# EAGLE design PCU (EAGLE 9.5.1)
ESKD_DESCRIPTION1: 207|235|224|242|224|32|192|208|202; ESKD_DESCRIPTION2: 241|245|229|236|224|32|253|235|229|234|242|240|232|247|229|241|234|224|255; ESKD_DESCRIPTION3: 239|240|232|237|246|232|239|232|224|235|252|237|224|255; ESKD_NUMBER: 67|67|83|49|46|51|49|48|48|45|48|221|51; ESKD_NUMBER_SHEET: 49; ESKD_SHEETS: 49
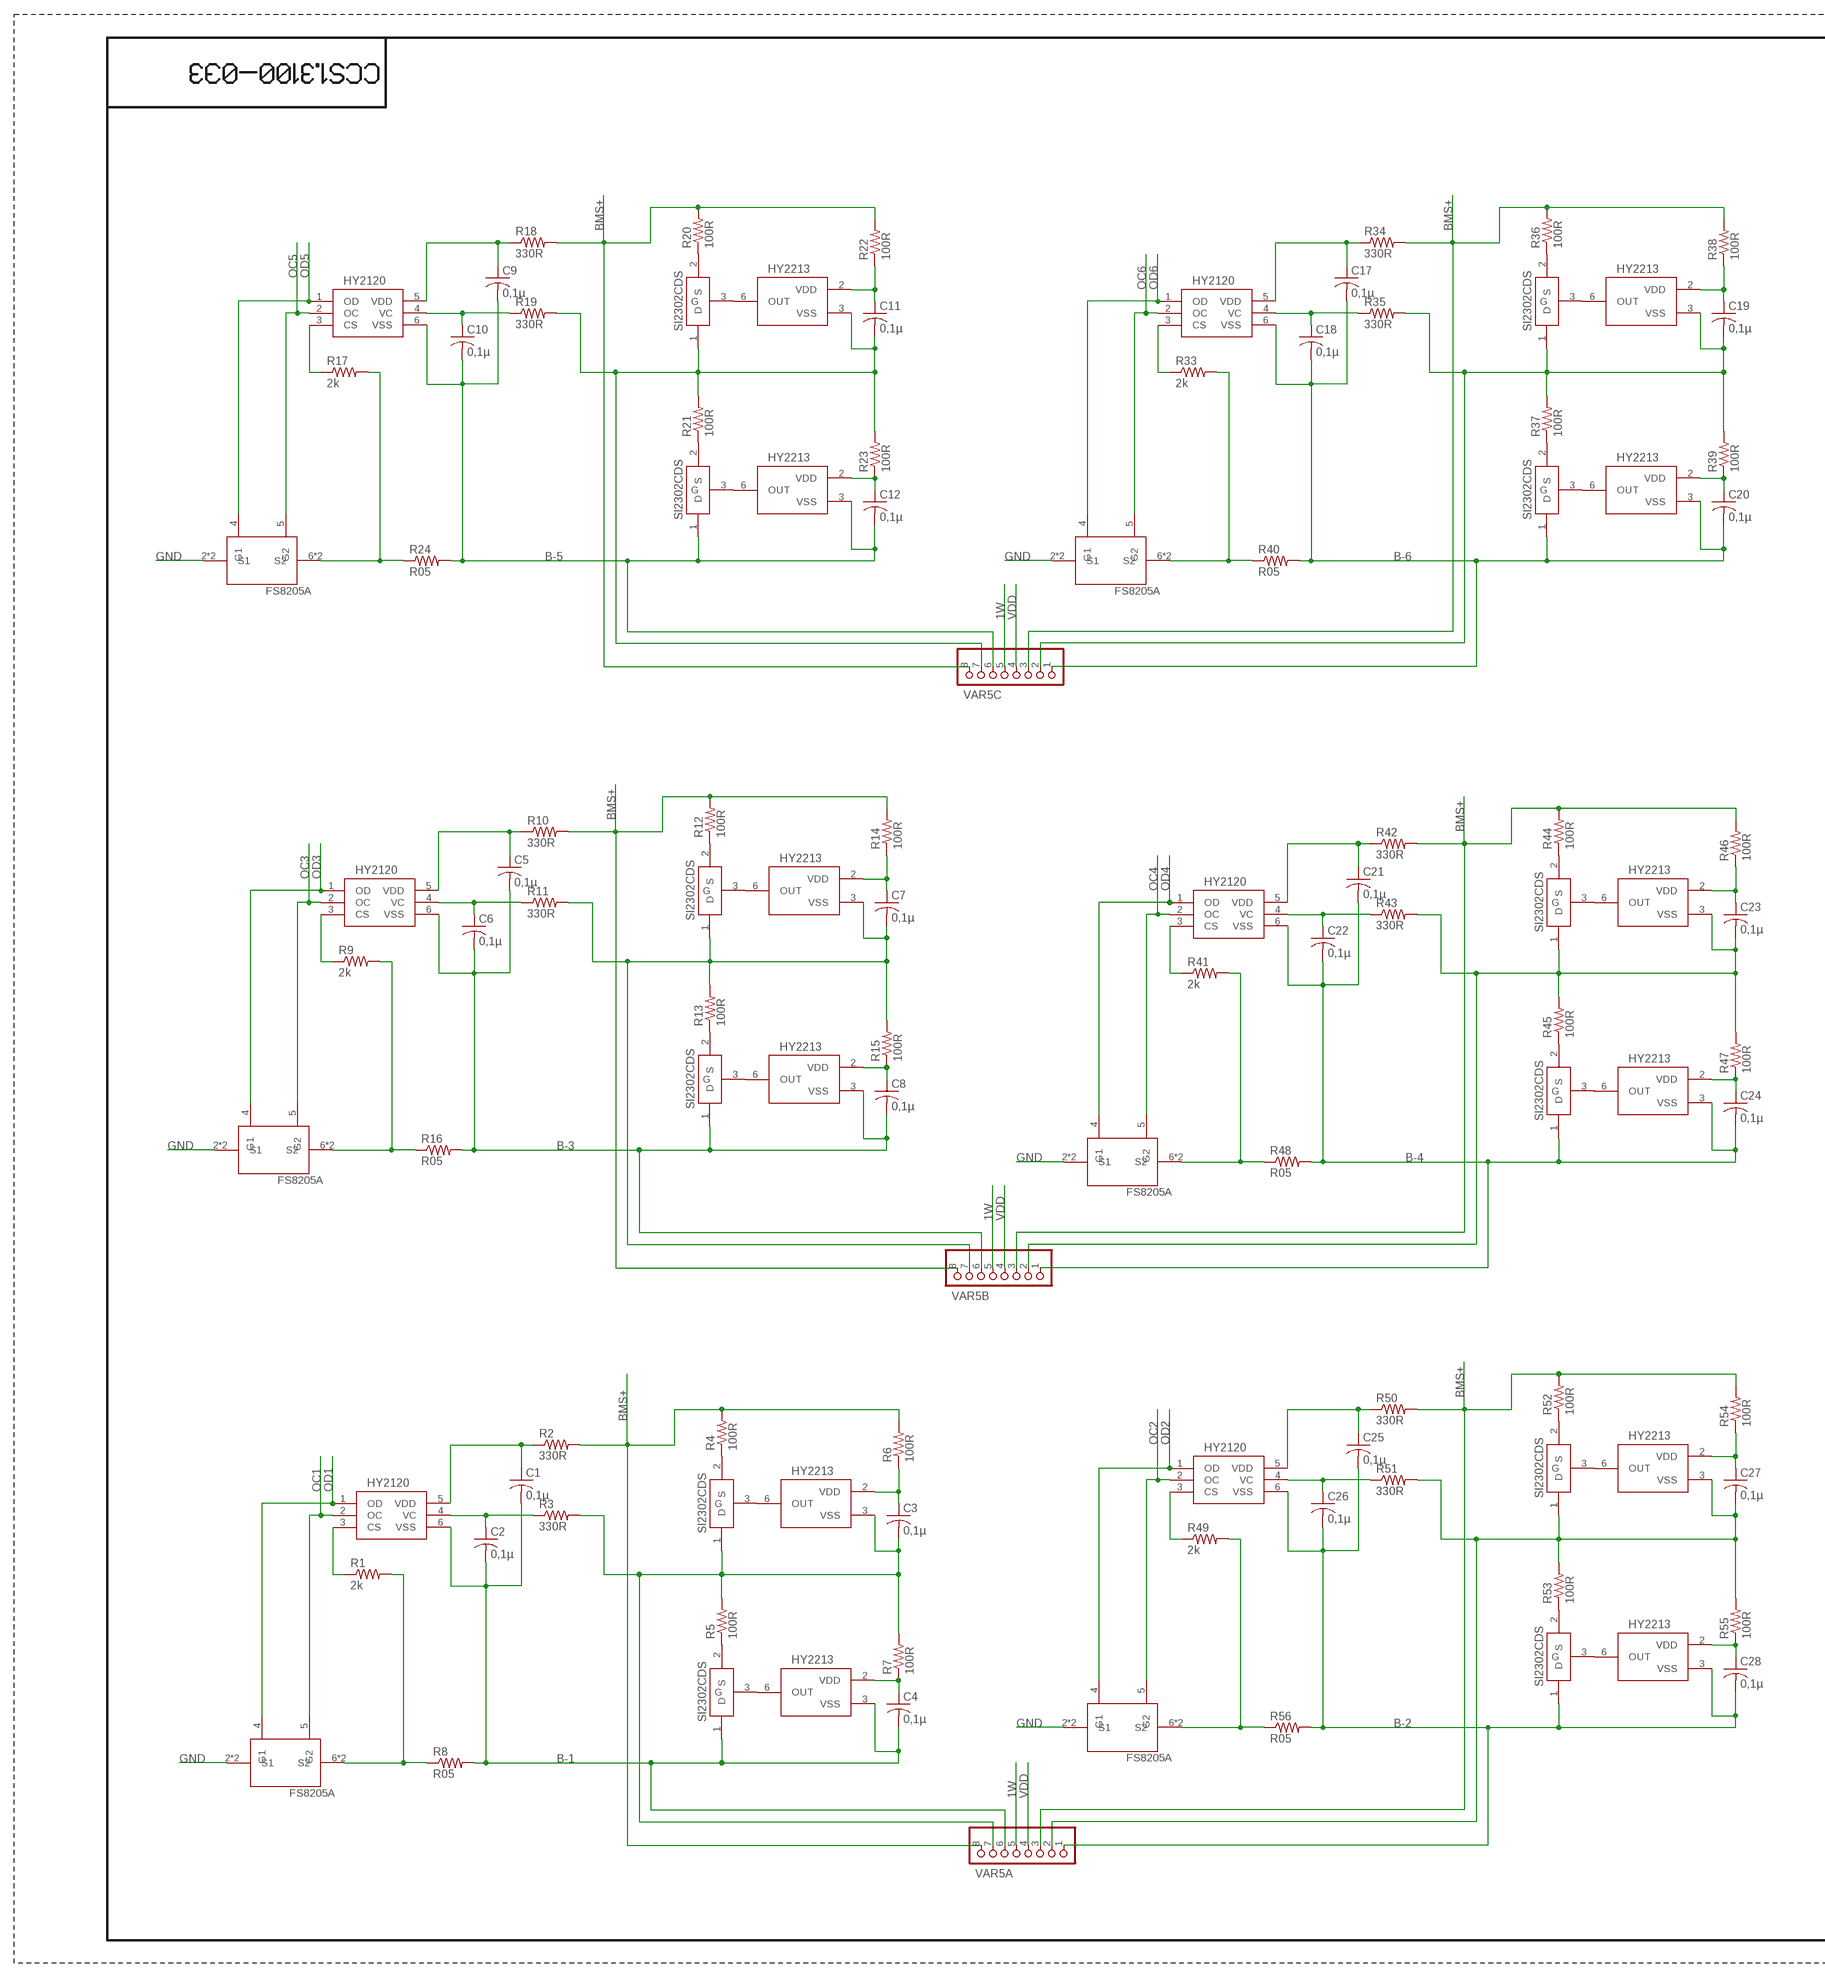
[diagram p0: schematic, sheet 1, part 1 of 2]
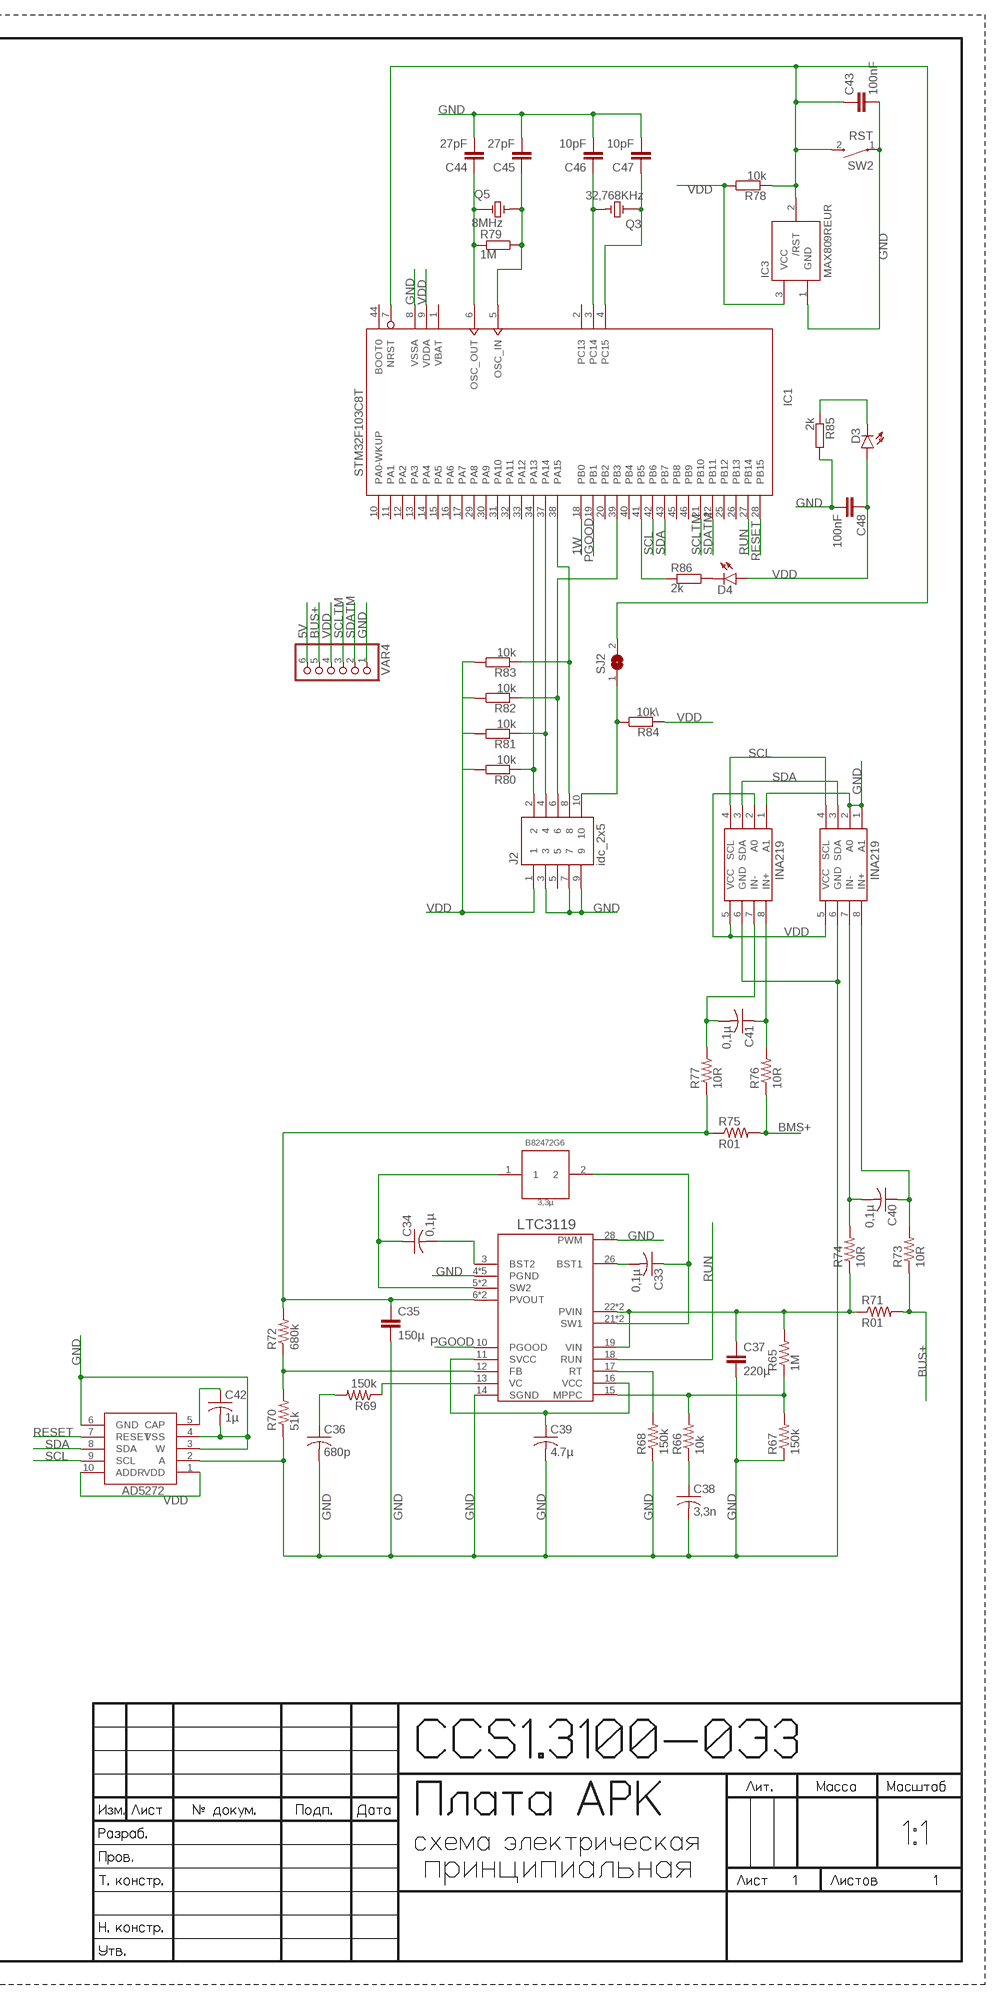
[diagram p1: schematic, sheet 1, part 2 of 2]

## Parts
3,3µH  3,3µ  B82472G6  [B82472G6]
C1  0,1µ  C-USC0603  [C0603]
C2  0,1µ  C-USC0603  [C0603]
C3  0,1µ  C-USC0603  [C0603]
C4  0,1µ  C-USC0603  [C0603]
C5  0,1µ  C-USC0603  [C0603]
C6  0,1µ  C-USC0603  [C0603]
C7  0,1µ  C-USC0603  [C0603]
C8  0,1µ  C-USC0603  [C0603]
C9  0,1µ  C-USC0603  [C0603]
C10  0,1µ  C-USC0603  [C0603]
C11  0,1µ  C-USC0603  [C0603]
C12  0,1µ  C-USC0603  [C0603]
C17  0,1µ  C-USC0603  [C0603]
C18  0,1µ  C-USC0603  [C0603]
C19  0,1µ  C-USC0603  [C0603]
C20  0,1µ  C-USC0603  [C0603]
C21  0,1µ  C-USC0603  [C0603]
C22  0,1µ  C-USC0603  [C0603]
C23  0,1µ  C-USC0603  [C0603]
C24  0,1µ  C-USC0603  [C0603]
C25  0,1µ  C-USC0603  [C0603]
C26  0,1µ  C-USC0603  [C0603]
C27  0,1µ  C-USC0603  [C0603]
C28  0,1µ  C-USC0603  [C0603]
C33  0,1µ  C-USC0603  [C0603]
C34  0,1µ  C-USC0603  [C0603]
C35  150µ  ECAPECAP150  [ECAP150]
C36  680p  C-USC1206  [C1206]
C37  220µ  ECAPECAP220  [ECAP220]
C38  3,3n  C-USC1206  [C1206]
C39  4.7µ  C-USC1206  [C1206]
C40  0,1µ  C-USC0603  [C0603]
C41  0,1µ  C-USC0603  [C0603]
C42  1µ  C-USC0603  [C0603]
C43  100nF  C-EUC0603  [C0603]
C44  27pF  C-EUC0603  [C0603]
C45  27pF  C-EUC0603  [C0603]
C46  10pF  C-EUC0603  [C0603]
C47  10pF  C-EUC0603  [C0603]
C48  100nF  C-EUC0603  [C0603]
D3  HLMP6  [HLMP6]
D4  HLMP6  [HLMP6]
IC1  STM32F103C8T  [LQFP48]
IC3  MAX809REUR  MAX809EUR  [SOT23]
J2  idc_2x5  3221-10-0100-00  [CNC_3221-10-0100-00]
Q3  32,768KHz  9C-8.000MEEJ-T  [XTAL_9C-8.000MEEJ-T]
Q5  8MHz  9C-8.000MEEJ-T  [XTAL_9C-8.000MEEJ-T]
R1  2k  R-US_R0603  [R0603]
R2  330R  R-US_R0603  [R0603]
R3  330R  R-US_R0603  [R0603]
R4  100R  R-US_R0603  [R0603]
R5  100R  R-US_R0603  [R0603]
R6  100R  R-US_R0603  [R0603]
R7  100R  R-US_R0603  [R0603]
R8  R05  R-US_R2512  [R2512]
R9  2k  R-US_R0603  [R0603]
R10  330R  R-US_R0603  [R0603]
R11  330R  R-US_R0603  [R0603]
R12  100R  R-US_R0603  [R0603]
R13  100R  R-US_R0603  [R0603]
R14  100R  R-US_R0603  [R0603]
R15  100R  R-US_R0603  [R0603]
R16  R05  R-US_R2512  [R2512]
R17  2k  R-US_R0603  [R0603]
R18  330R  R-US_R0603  [R0603]
R19  330R  R-US_R0603  [R0603]
R20  100R  R-US_R0603  [R0603]
R21  100R  R-US_R0603  [R0603]
R22  100R  R-US_R0603  [R0603]
R23  100R  R-US_R0603  [R0603]
R24  R05  R-US_R2512  [R2512]
R33  2k  R-US_R0603  [R0603]
R34  330R  R-US_R0603  [R0603]
R35  330R  R-US_R0603  [R0603]
R36  100R  R-US_R0603  [R0603]
R37  100R  R-US_R0603  [R0603]
R38  100R  R-US_R0603  [R0603]
R39  100R  R-US_R0603  [R0603]
R40  R05  R-US_R2512  [R2512]
R41  2k  R-US_R0603  [R0603]
R42  330R  R-US_R0603  [R0603]
R43  330R  R-US_R0603  [R0603]
R44  100R  R-US_R0603  [R0603]
R45  100R  R-US_R0603  [R0603]
R46  100R  R-US_R0603  [R0603]
R47  100R  R-US_R0603  [R0603]
R48  R05  R-US_R2512  [R2512]
R49  2k  R-US_R0603  [R0603]
R50  330R  R-US_R0603  [R0603]
R51  330R  R-US_R0603  [R0603]
R52  100R  R-US_R0603  [R0603]
R53  100R  R-US_R0603  [R0603]
R54  100R  R-US_R0603  [R0603]
R55  100R  R-US_R0603  [R0603]
R56  R05  R-US_R2512  [R2512]
R65  1M  R-US_R0603  [R0603]
R66  10k  R-US_R0603  [R0603]
R67  150k  R-US_R0603  [R0603]
R68  150k  R-US_R0603  [R0603]
R69  150k  R-US_R0603  [R0603]
R70  51k  R-US_R0603  [R0603]
R71  R01  R-US_R2512  [R2512]
R72  680k  R-US_R0603  [R0603]
R73  10R  R-US_R0603  [R0603]
R74  10R  R-US_R0603  [R0603]
R75  R01  R-US_R2512  [R2512]
R76  10R  R-US_R0603  [R0603]
R77  10R  R-US_R0603  [R0603]
R78  10k  BVS  [BVS]
R79  1M  BVS  [BVS]
R80  10k  BVS  [BVS]
R81  10k  BVS  [BVS]
R82  10k  BVS  [BVS]
R83  10k  BVS  [BVS]
R84  10k\  BVS  [BVS]
R85  2k  BVS  [BVS]
R86  2k  BVS  [BVS]
SJ2  SJW  [SJW]
SW2  RST  1437566-3  [SW_1437566-3]
U$1  FS8205A  [FS8205A]
U$3  HY2120  [HY2120]
U$4  HY2213  [HY2213]
U$5  HY2213  [HY2213]
U$6  SI2302CDS  [SI2302CDS]
U$7  SI2302CDS  [SI2302CDS]
U$8  FS8205A  [FS8205A]
U$10  HY2120  [HY2120]
U$11  HY2213  [HY2213]
U$12  HY2213  [HY2213]
U$13  SI2302CDS  [SI2302CDS]
U$14  SI2302CDS  [SI2302CDS]
U$15  FS8205A  [FS8205A]
U$17  HY2120  [HY2120]
U$18  HY2213  [HY2213]
U$19  HY2213  [HY2213]
U$20  SI2302CDS  [SI2302CDS]
U$21  SI2302CDS  [SI2302CDS]
U$29  FS8205A  [FS8205A]
U$31  HY2120  [HY2120]
U$32  HY2213  [HY2213]
U$33  HY2213  [HY2213]
U$34  SI2302CDS  [SI2302CDS]
U$35  SI2302CDS  [SI2302CDS]
U$36  FS8205A  [FS8205A]
U$38  HY2120  [HY2120]
U$39  HY2213  [HY2213]
U$40  HY2213  [HY2213]
U$41  SI2302CDS  [SI2302CDS]
U$42  SI2302CDS  [SI2302CDS]
U$43  FS8205A  [FS8205A]
U$45  HY2120  [HY2120]
U$46  HY2213  [HY2213]
U$47  HY2213  [HY2213]
U$48  SI2302CDS  [SI2302CDS]
U$49  SI2302CDS  [SI2302CDS]
U$57  INA219AID  [INA219AID]
U$58  INA219AID  [INA219AID]
U$59  LTC3119  [LTC3119]
U$60  AD5272  [AD5272]
VAR4  PINHD-1X6  [1X06]
VAR5A  PINHD-1X8  [1X08]
VAR5B  PINHD-1X8  [1X08]
VAR5C  PINHD-1X8  [1X08]

## Nets
1W: IC1.18(PB0) VAR5A.5 VAR5B.5 VAR5C.5
5V: VAR4.6
B-1: C1.2 C2.2 C4.2 R8.2 U$3.6(VSS) U$5.3(VSS) U$7.1(D) VAR5A.6
B-2: C25.2 C26.2 C28.2 R56.2 U$45.6(VSS) U$47.3(VSS) U$49.1(D) VAR5A.1
B-3: C5.2 C6.2 C8.2 R16.2 U$10.6(VSS) U$12.3(VSS) U$14.1(D) VAR5B.6
B-4: C21.2 C22.2 C24.2 R48.2 U$38.6(VSS) U$40.3(VSS) U$42.1(D) VAR5B.1
B-5: C9.2 C10.2 C12.2 R24.2 U$17.6(VSS) U$19.3(VSS) U$21.1(D) VAR5C.6
B-6: C17.2 C18.2 C20.2 R40.2 U$31.6(VSS) U$33.3(VSS) U$35.1(D) VAR5C.1
BMS+: R2.2 R4.2 R6.2 R10.2 R12.2 R14.2 R18.2 R20.2 R22.2 R34.2 R36.2 R38.2 R42.2 R44.2 R46.2 R50.2 R52.2 R54.2 R75.2 R76.1 VAR5A.3 VAR5A.8 VAR5B.3 VAR5B.8 VAR5C.3 VAR5C.8
BUS+: R71.2 R73.1 VAR4.5
GND: C35.P$2 C36.2 C37.P$2 C38.2 C39.2 C42.2 C43.2 C44.2 C45.2 C46.2 C47.2 C48.2 IC1.8(VSSA) IC3.1(GND) J2.3 J2.7 J2.9 R67.1 R68.1 R70.1 R85.1 SW2.1 U$1.2(S1) U$1.3(S1) U$8.2(S1) U$8.3(S1) U$15.2(S1) U$15.3(S1) U$29.2(S1) U$29.3(S1) U$36.2(S1) U$36.3(S1) U$43.2(S1) U$43.3(S1) U$57.1(A1) U$57.6(GND) U$58.1(A1) U$58.2(A0) U$58.6(GND) U$59.4(PGND) U$59.9(PGND) U$59.14(SGND) U$59.20(PGND) U$59.25(PGND) U$59.28(PWM) U$59.29(PGND) U$60.2(A) U$60.3(W) U$60.4(VSS) U$60.6(GND) VAR4.1
N$1: C1.1 R2.1 U$3.5(VDD)
N$2: C4.1 R7.1 U$5.2(VDD)
N$3: R1.1 U$3.3(CS)
N$4: C3.1 R6.1 U$4.2(VDD)
N$5: C43.1 IC1.7(NRST) IC3.2(/RST) R78.2 SJ2.2 SW2.2
N$6: U$4.6(OUT) U$6.3(G)
N$7: R4.1 U$6.2(S)
N$8: C3.2 R3.2 R5.2 R7.2 U$4.3(VSS) U$6.1(D) VAR5A.7
N$9: U$5.6(OUT) U$7.3(G)
N$10: R5.1 U$7.2(S)
N$13: R1.2 R8.1 U$1.6(S2) U$1.7(S2)
N$15: C2.1 R3.1 U$3.4(VC)
N$16: C5.1 R10.1 U$10.5(VDD)
N$18: R9.1 U$10.3(CS)
N$19: C7.1 R14.1 U$11.2(VDD)
N$20: U$11.6(OUT) U$13.3(G)
N$21: R12.1 U$13.2(S)
N$22: U$12.6(OUT) U$14.3(G)
N$23: R13.1 U$14.2(S)
N$24: R9.2 R16.1 U$8.6(S2) U$8.7(S2)
N$27: C6.1 R11.1 U$10.4(VC)
N$28: C8.1 R15.1 U$12.2(VDD)
N$30: C7.2 R11.2 R13.2 R15.2 U$11.3(VSS) U$13.1(D) VAR5B.7
N$33: C9.1 R18.1 U$17.5(VDD)
N$34: R17.1 U$17.3(CS)
N$35: C11.1 R22.1 U$18.2(VDD)
N$36: U$18.6(OUT) U$20.3(G)
N$37: R20.1 U$20.2(S)
N$38: U$19.6(OUT) U$21.3(G)
N$39: R21.1 U$21.2(S)
N$40: R17.2 R24.1 U$15.6(S2) U$15.7(S2)
N$43: C10.1 R19.1 U$17.4(VC)
N$44: C12.1 R23.1 U$19.2(VDD)
N$46: C11.2 R19.2 R21.2 R23.2 U$18.3(VSS) U$20.1(D) VAR5C.7
N$65: C17.1 R34.1 U$31.5(VDD)
N$66: R33.1 U$31.3(CS)
N$67: C19.1 R38.1 U$32.2(VDD)
N$68: U$32.6(OUT) U$34.3(G)
N$69: R36.1 U$34.2(S)
N$70: U$33.6(OUT) U$35.3(G)
N$71: R37.1 U$35.2(S)
N$72: R33.2 R40.1 U$29.6(S2) U$29.7(S2)
N$75: C18.1 R35.1 U$31.4(VC)
N$76: C20.1 R39.1 U$33.2(VDD)
N$78: C19.2 R35.2 R37.2 R39.2 U$32.3(VSS) U$34.1(D) VAR5C.2
N$81: C21.1 R42.1 U$38.5(VDD)
N$82: R41.1 U$38.3(CS)
N$83: C23.1 R46.1 U$39.2(VDD)
N$84: U$39.6(OUT) U$41.3(G)
N$85: R44.1 U$41.2(S)
N$86: U$40.6(OUT) U$42.3(G)
N$87: R45.1 U$42.2(S)
N$88: R41.2 R48.1 U$36.6(S2) U$36.7(S2)
N$91: C22.1 R43.1 U$38.4(VC)
N$92: C24.1 R47.1 U$40.2(VDD)
N$94: C23.2 R43.2 R45.2 R47.2 U$39.3(VSS) U$41.1(D) VAR5B.2
N$97: C25.1 R50.1 U$45.5(VDD)
N$98: R49.1 U$45.3(CS)
N$99: C27.1 R54.1 U$46.2(VDD)
N$100: U$46.6(OUT) U$48.3(G)
N$101: R52.1 U$48.2(S)
N$102: U$47.6(OUT) U$49.3(G)
N$103: R53.1 U$49.2(S)
N$104: R49.2 R56.1 U$43.6(S2) U$43.7(S2)
N$107: C26.1 R51.1 U$45.4(VC)
N$108: C28.1 R55.1 U$47.2(VDD)
N$110: C27.2 R51.2 R53.2 R55.2 U$46.3(VSS) U$48.1(D) VAR5A.2
N$129: C34.2 U$59.3(BST2)
N$131: 3,3µH.2 C33.1 U$59.21(SW1) U$59.24(SW1)
N$132: 3,3µH.1 C34.1 U$59.5(SW2) U$59.8(SW2)
N$133: C44.1 IC1.6(OSC_OUT) Q5.1 R79.2
N$134: C35.P$1 R72.2 R75.1 R77.1 U$59.6(PVOUT) U$59.7(PVOUT)
N$135: R69.1 U$59.13(VC)
N$136: C36.1 R69.2
N$137: C37.P$1 R65.2 R71.1 R74.1 U$59.19(VIN) U$59.22(PVIN) U$59.23(PVIN)
N$138: R65.1 R66.2 R67.2 U$59.15(MPPC)
N$139: C38.1 R66.1
N$140: C39.1 U$59.11(SVCC) U$59.16(VCC)
N$141: C40.2 R74.2 U$58.7(IN-)
N$142: R68.2 U$59.17(RT)
N$143: R70.2 R72.1 U$59.12(FB)
N$144: C33.2 U$59.26(BST1)
N$145: C45.1 IC1.5(OSC_IN) Q5.2 R79.1
N$147: C40.1 R73.2 U$58.8(IN+)
N$148: C47.1 IC1.4(PC15) Q3.1
N$150: C41.1 R76.2 U$57.8(IN+)
N$151: C41.2 R77.2 U$57.7(IN-)
N$152: C46.1 IC1.3(PC14) Q3.2
N$153: IC1.34(PA13) J2.2 R80.2
N$154: C42.1 U$60.5(CAP)
N$155: IC1.37(PA14) J2.4 R81.2
N$156: IC1.38(PA15) J2.8 R83.2
N$157: IC1.39(PB3) J2.6 R82.2
N$158: J2.10 R84.1 SJ2.1
N$159: D3.K R85.2
N$160: D4.K R86.1
N$161: IC1.41(PB5) R86.2
OC1: U$1.5(G2) U$3.2(OC)
OC2: U$43.5(G2) U$45.2(OC)
OC3: U$8.5(G2) U$10.2(OC)
OC4: U$36.5(G2) U$38.2(OC)
OC5: U$15.5(G2) U$17.2(OC)
OC6: U$29.5(G2) U$31.2(OC)
OD1: U$1.4(G1) U$3.1(OD)
OD2: U$43.4(G1) U$45.1(OD)
OD3: U$8.4(G1) U$10.1(OD)
OD4: U$36.4(G1) U$38.1(OD)
OD5: U$15.4(G1) U$17.1(OD)
OD6: U$29.4(G1) U$31.1(OD)
PGOOD: IC1.19(PB1) U$59.10(PGOOD)
RESET: IC1.28(PB15) U$60.7(RESET)
RUN: IC1.27(PB14) U$59.18(RUN)
SCL: IC1.42(PB6) U$57.4(SCL) U$58.4(SCL) U$60.9(SCL)
SCLTM: IC1.21(PB10) VAR4.3
SDA: IC1.43(PB7) U$57.3(SDA) U$58.3(SDA) U$60.8(SDA)
SDATM: IC1.22(PB11) VAR4.2
VDD: C48.1 D3.A D4.A IC1.9(VDDA) IC3.3(VCC) J2.1 R78.1 R80.1 R81.1 R82.1 R83.1 R84.2 U$57.2(A0) U$57.5(VCC) U$58.5(VCC) U$60.1(VDD) U$60.10(ADDR) VAR4.4 VAR5A.4 VAR5B.4 VAR5C.4
Unconnected: IC1.2(PC13) IC1.10(PA0-WKUP) IC1.11(PA1) IC1.12(PA2) IC1.13(PA3) IC1.14(PA4) IC1.15(PA5) IC1.16(PA6) IC1.17(PA7) IC1.20(PB2) IC1.25(PB12) IC1.26(PB13) IC1.29(PA8) IC1.30(PA9) IC1.31(PA10) IC1.32(PA11) IC1.33(PA12) IC1.40(PB4) IC1.44(BOOT0) IC1.45(PB8) IC1.46(PB9) J2.5

## Power pins joined to a net without a drawn wire
VBAT: IC1.1(VBAT)
VDD: IC1.24(VDD) IC1.36(VDD) IC1.48(VDD)
VSS: IC1.23(VSS) IC1.35(VSS) IC1.47(VSS)

## Library data of the parts
3,3µH = CanCubeSat:B82472G6
C1-C12 C17-C28 C33 C34 C36 C38-C42 = rcl:C-US: CAPACITOR, American symbol; SPICEPREFIX: C
C35 C37 = CanCubeSat:ECAP
C43-C48 = rcl:C-EU: CAPACITOR, European symbol; SPICEPREFIX: C
D3 D4 = display-hp:HLMP6: LED 2mm horizontal; MF: AGILENT TECHNOLOGIES; MPN: HLMP-6500; OC_FARNELL: 1652490; OC_NEWARK: 40K0088
IC1 = micro-stm:STM32F103C*T: ARM 32-bit Cortex™-M3 CPU 72 MHz maximum frequency 16 to 128 Kbytes of Flash memory 6 to 20 kbytes of SRAM 37 GPIOs 2.0 to 3.6 V application supply
IC3 = MAX809_:MAX809*: 3-Pin Microprocessor Reset Circuit; AVAILABILITY: Unavailable; DESCRIPTION: ON Semiconductor ANA 1.20V MCROPROC RESET; MF: ON Semiconductor; MP: MAX809; PACKAGE: SOT-23 Maxim Integrated; PRICE: None
J2 = idc_2x5:3221-10-0100-00: Idc Box Header .050" 10pos; AVAILABILITY: Unavailable; DESCRIPTION: Idc Box Header .050 10pos; MF: CNC Tech; MP: 3221-10-0100-00; PACKAGE: None; PRICE: None
Q3 Q5 = 9C-8.000MEEJ-T:9C-8.000MEEJ-T: Crystal, 8mhz, 18pf, Hc-49s; AVAILABILITY: Unavailable; DESCRIPTION: Crystal, 8mhz, 18pf, Hc-49s; MF: TXC CORPORATION; MP: 9C-8.000MEEJ-T; PACKAGE: HC49/US TXC; PRICE: None
R1-R7 R9-R15 R17-R23 R33-R39 R41-R47 R49-R55 R65-R70 R72-R74 R76 R77 = resistor:R-US_: RESISTOR, American symbol
R8 R16 R24 R40 R48 R56 R71 R75 = rcl:R-US_: RESISTOR, American symbol; SPICEPREFIX: R
R78-R86 = resistor-shunt:BVS: SMD SHUNT RESISTOR; OC_FARNELL: unknown; OC_NEWARK: unknown
SJ2 = jumper:SJ: SMD solder JUMPER
SW2 = 1437566-3:1437566-3: Switch Tactile OFF (ON) SPST Rectangular Button Gull Wing 0.05A 12VDC SMD Loose Piece; AVAILABILITY: Unavailable; COMMENT: 1437566-3; CONFIGURATION_POLE-THROW: Single Pole - Single Throw; CONTACT_CURRENT_RATING: 50 mA; DESCRIPTION: Switch Tactile OFF _ON_ SPST Rectangular Button Gull Wing 0.05A 12VDC SMD Loose Piece; MF: TE Connectivity; MP: 1437566-3; PACKAGE: None; PRICE: None; TE_PURCHASE_URL: https://www.te.com/usa-en/product-1437566-3.html?te_bu=Cor&te_type=disp&te_campaign=seda_glo_cor-seda-global-disp-prtnr-fy19-seda-model-bom-cta_sma-317_1&elqCampaignId=32493
U$1 U$8 U$15 U$29 U$36 U$43 = CanCubeSat:FS8205A
U$3 U$10 U$17 U$31 U$38 U$45 = CanCubeSat:HY2120
U$4 U$5 U$11 U$12 U$18 U$19 U$32 U$33 U$39 U$40 U$46 U$47 = CanCubeSat:HY2213
U$6 U$7 U$13 U$14 U$20 U$21 U$34 U$35 U$41 U$42 U$48 U$49 = CanCubeSat:SI2302CDS
U$57 U$58 = CanCubeSat:INA219AID
U$59 = CanCubeSat:LTC3119
U$60 = CanCubeSat:AD5272
VAR4 = pinheadCS:PINHD-1X6: PIN HEADER
VAR5A VAR5B VAR5C = pinheadCS:PINHD-1X8: PIN HEADER

## Board
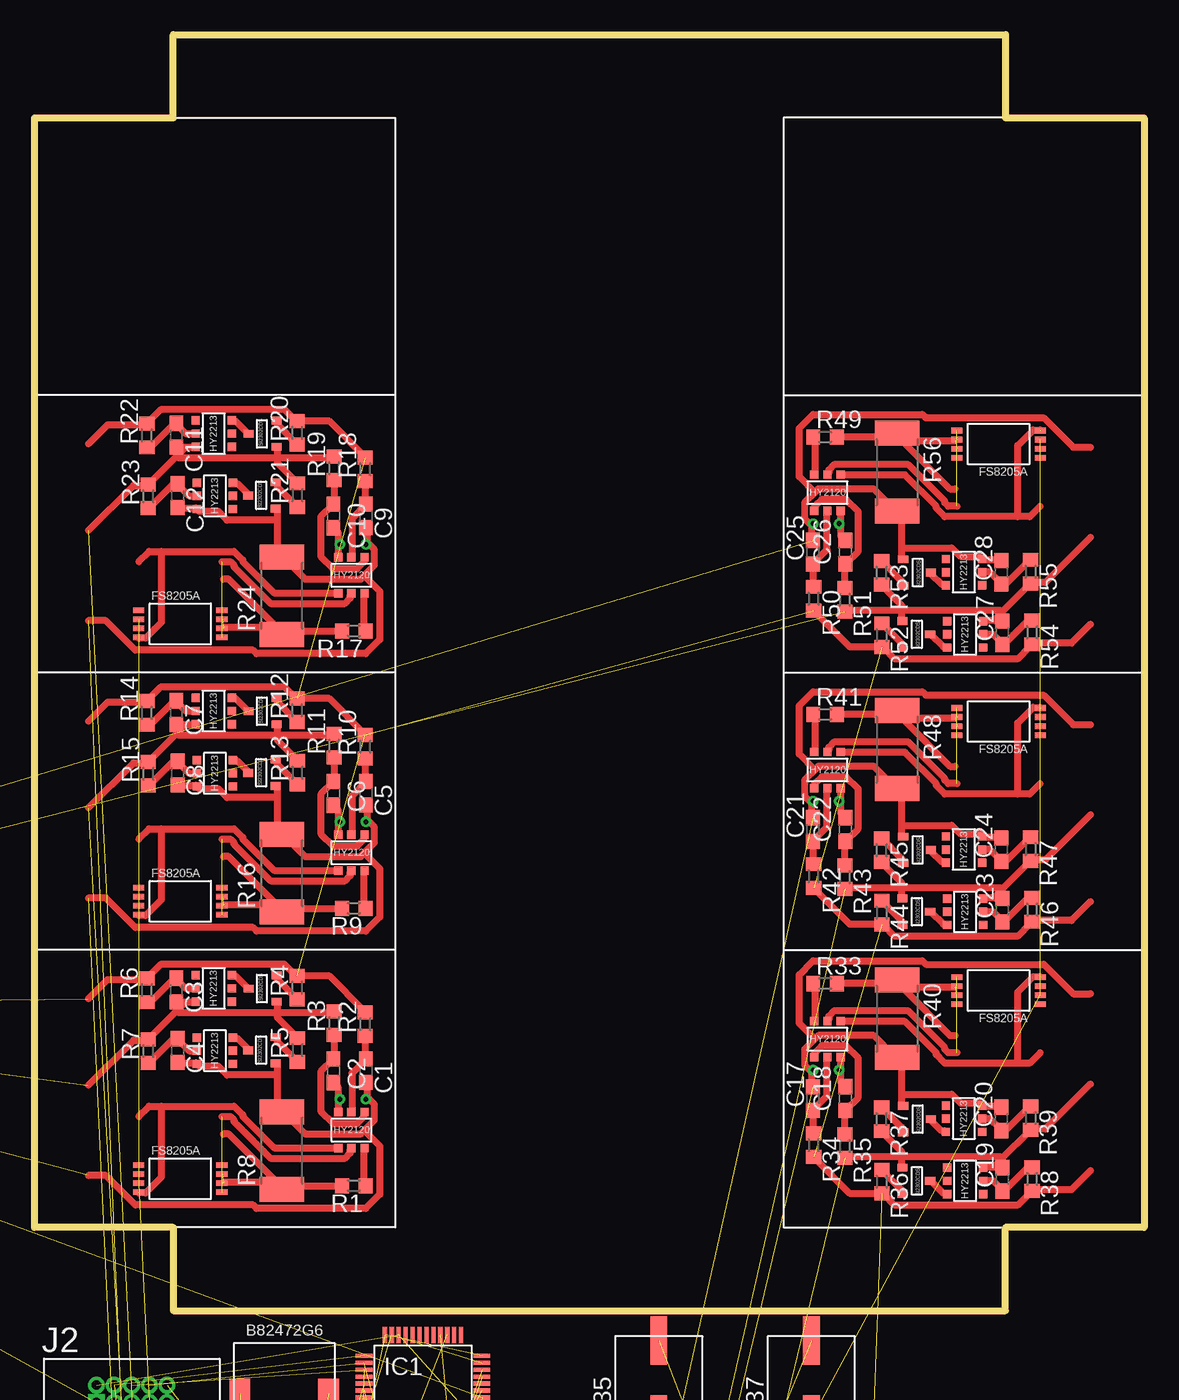
[diagram p2: board, top side]
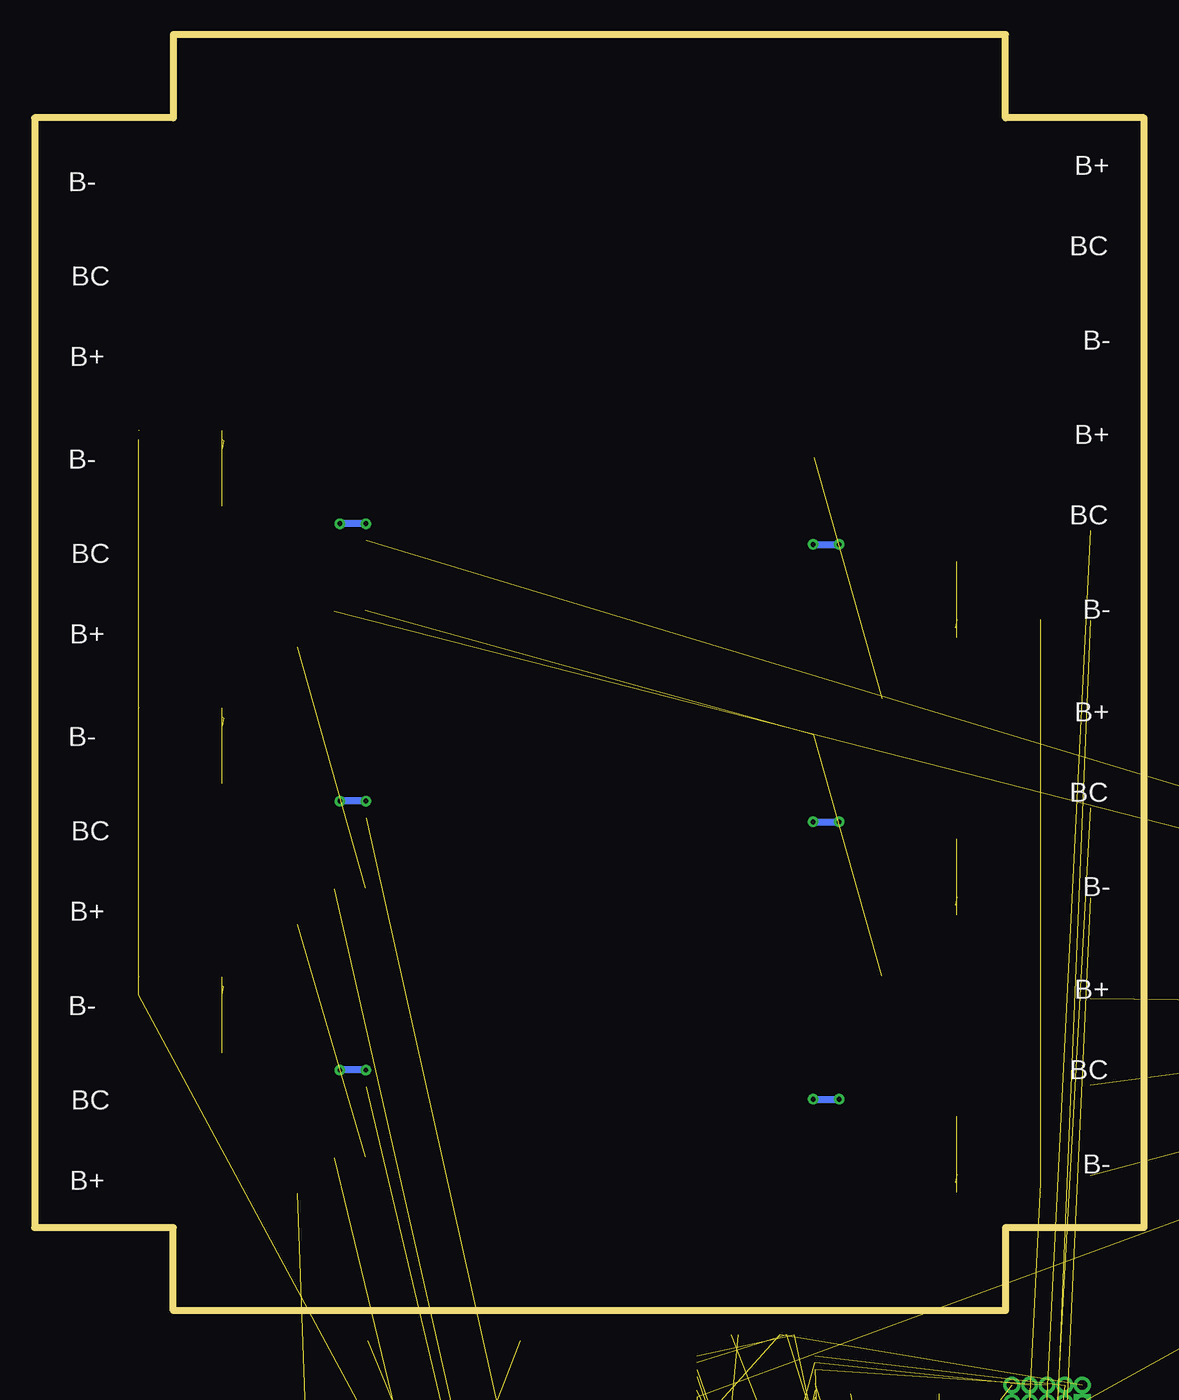
[diagram p3: board, bottom side, seen from below]

Size 80 x 92 mm. Coordinates in mm from the lower left corner, seen from the top.
Outline: 0,6 0,86 10,86 10,92 70,92 70,86 80,86 80,6 70,6 70,0 10,0 10,6 0,6
Copper layers (1*16): Top 0.035mm / dielectric 1.5mm / Bottom 0.035mm
Design rules "default *": minimum track width 0.5mm, minimum drill 0.35mm, track to track 6mil, track to pad 6mil, pad to pad 6mil, via to via 6mil, smd to smd 6mil, copper to edge 40mil, drill to drill 6mil, minimum pad ring 10mil, minimum via ring 8mil, stop-mask expansion 4mil, vias tented up to drill 0mil, thermal gap 10mil

### Footprints (pad centres in the part's own frame; a part is rotated, then mirrored left to right if it is on the bottom)
B82472G6 = smd 1.5 x 2.2: 1 -3.2,0; 2 3.2,0
C0603 = smd 1.1 x 1: 1 -0.85,0; 2 0.85,0
ECAP150 = smd 1.2 x 3.5: P$1 0,2.85; P$2 0,-2.85
C1206 = smd 1.6 x 1.8: 1 -1.4,0; 2 1.4,0
ECAP220 = smd 1.2 x 3.5: P$1 0,2.85; P$2 0,-2.85
HLMP6 = drill 0.813 long: A -1.27,0; K 1.27,0
LQFP48 = smd 0.3 x 1.2: 1 -2.75,-4.25; 2 -2.25,-4.25; 3 -1.75,-4.25; 4 -1.25,-4.25; 5 -0.75,-4.25; 6 -0.25,-4.25; 7 0.25,-4.25; 8 0.75,-4.25; 9 1.25,-4.25; 10 1.75,-4.25; 11 2.25,-4.25; 12 2.75,-4.25; 25 2.75,4.25; 26 2.25,4.25; 27 1.75,4.25; 28 1.25,4.25; 29 0.75,4.25; 30 0.25,4.25; 31 -0.25,4.25; 32 -0.75,4.25; 33 -1.25,4.25; 34 -1.75,4.25; 35 -2.25,4.25; 36 -2.75,4.25 | smd 1.2 x 0.3: 13 4.25,-2.75; 14 4.25,-2.25; 15 4.25,-1.75; 16 4.25,-1.25; 17 4.25,-0.75; 18 4.25,-0.25; 19 4.25,0.25; 20 4.25,0.75; 21 4.25,1.25; 22 4.25,1.75; 23 4.25,2.25; 24 4.25,2.75; 37 -4.25,2.75; 38 -4.25,2.25; 39 -4.25,1.75; 40 -4.25,1.25; 41 -4.25,0.75; 42 -4.25,0.25; 43 -4.25,-0.25; 44 -4.25,-0.75; 45 -4.25,-1.25; 46 -4.25,-1.75; 47 -4.25,-2.25; 48 -4.25,-2.75
SOT23 = smd 1 x 1.4: 1 -0.95,-1.1; 2 0.95,-1.1; 3 0,1.1
CNC_3221-10-0100-00 = drill 0.7 pad 1.1 square: 1 -2.54,-0.635 | drill 0.7 pad 1.1: 2 -2.54,0.635; 3 -1.27,-0.635; 4 -1.27,0.635; 5 0,-0.635; 6 0,0.635; 7 1.27,-0.635; 8 1.27,0.635; 9 2.54,-0.635; 10 2.54,0.635
XTAL_9C-8.000MEEJ-T = smd 5.5 x 2: 1 -4.75,0; 2 4.75,0
R0603 = smd 1 x 1.1: 1 -0.85,0; 2 0.85,0
R2512 = smd 1.8 x 3.2: 1 -2.8,0; 2 2.8,0
BVS = smd 2.7 x 6.2: 1 -4.14,0; 2 4.14,0
SJW = smd 1.27 x 2.54: 1 -1.27,0; 2 1.27,0
SW_1437566-3 = smd 2.18 x 1.6: 1 -4.6,0; 2 4.6,0
FS8205A = smd 0.4 x 0.8: 1 -0.975,-3; 2 -0.325,-3; 3 0.325,-3; 4 0.975,-3; 5 0.975,3; 6 0.325,3; 7 -0.325,3; 8 -0.975,3
HY2120 = smd 0.6 x 0.6: 1 -0.95,-1.3; 2 0,-1.3; 3 0.95,-1.3; 4 0.95,1.3; 5 0,1.3; 6 -0.95,1.3
HY2213 = smd 0.6 x 0.6: 1 -0.95,-1.3; 2 0,-1.3; 3 0.95,-1.3; 4 0.95,1.3; 5 0,1.3; 6 -0.95,1.3
SI2302CDS = smd 0.56 x 0.73: 1 -0.95,-1; 2 0.95,-1; 3 0,1
INA219AID = smd 0.9 x 0.45: 1 -1.3,0.97; 2 -1.3,0.32; 3 -1.3,-0.32; 4 -1.3,-0.97; 5 1.3,-0.97; 6 1.3,-0.32; 7 1.3,0.32; 8 1.3,0.97
LTC3119 = smd 0.45 x 1.05: 1 -4.225,-2.775; 2 -3.575,-2.775; 3 -2.925,-2.775; 4 -2.275,-2.775; 5 -1.625,-2.775; 6 -0.975,-2.775; 7 -0.325,-2.775; 8 0.325,-2.775; 9 0.975,-2.775; 10 1.625,-2.775; 11 2.275,-2.775; 12 2.925,-2.775; 13 3.575,-2.775; 14 4.225,-2.775; 15 4.225,2.775; 16 3.575,2.775; 17 2.925,2.775; 18 2.275,2.775; 19 1.625,2.775; 20 0.975,2.775; 21 0.325,2.775; 22 -0.325,2.775; 23 -0.975,2.775; 24 -1.625,2.775; 25 -2.275,2.775; 26 -2.925,2.775; 27 -3.575,2.775; 28 -4.225,2.775 | smd 7.56 x 3.05: 29 0,0
AD5272 = smd 0.3 x 1.275: 1 -1,-2.24; 2 -0.5,-2.24; 3 0,-2.24; 4 0.5,-2.24; 5 1,-2.24; 6 1,2.24; 7 0.5,2.24; 8 0,2.24; 9 -0.5,2.24; 10 -1,2.24
1X06 = drill 1.016 square: 1 -6.35,0 | drill 1.016 octagon: 2 -3.81,0; 3 -1.27,0; 4 1.27,0; 5 3.81,0; 6 6.35,0
1X08 = drill 1.016 square: 1 -8.89,0 | drill 1.016 octagon: 2 -6.35,0; 3 -3.81,0; 4 -1.27,0; 5 1.27,0; 6 3.81,0; 7 6.35,0; 8 8.89,0

### Placement (x,y rotation side)
3,3µH  18,-6 0 top  (outside the outline)
C1  23.88,17.31 270 top
C2  21.54,17.3 270 top
C3  10.22,23.12 270 top
C4  10.3,18.76 270 top
C5  23.88,37.31 270 top
C6  21.54,37.3 270 top
C7  10.22,43.12 270 top
C8  10.3,38.76 270 top
C9  23.88,57.31 270 top
C10  21.54,57.3 270 top
C11  10.22,63.12 270 top
C12  10.3,58.76 270 top
C17  56.12,15.29 90 top
C18  58.46,15.3 90 top
C19  69.78,9.48 90 top
C20  69.7,13.84 90 top
C21  56.12,34.69 90 top
C22  58.46,34.7 90 top
C23  69.78,28.88 90 top
C24  69.7,33.24 90 top
C25  56.12,54.69 90 top
C26  58.46,54.7 90 top
C27  69.78,48.88 90 top
C28  69.7,53.24 90 top
C33  14,-60 0 top  (outside the outline)
C34  19,-60 0 top  (outside the outline)
C35  45,-5 0 top
C36  15,-49 0 top  (outside the outline)
C37  56,-5 0 top
C38  27,-49 0 top  (outside the outline)
C39  21,-49 0 top  (outside the outline)
C40  24,-60 0 top  (outside the outline)
C41  29,-60 0 top  (outside the outline)
C42  34,-60 0 top  (outside the outline)
C43  -55,-239 0 top  (outside the outline)
C44  26,-55 0 top  (outside the outline)
C45  32,-55 0 top  (outside the outline)
C46  38,-55 0 top  (outside the outline)
C47  44,-55 0 top  (outside the outline)
C48  19,-55 0 top  (outside the outline)
D3  41,-65 0 top  (outside the outline)
D4  51,-65 0 top  (outside the outline)
IC1  28,-6 0 top
IC3  -54,-226 0 top  (outside the outline)
J2  7,-6 0 top  (outside the outline)
Q3  9,-17 0 top  (outside the outline)
Q5  26,-17 0 top  (outside the outline)
R1  23.02,9.01 180 top
R2  23.83,20.66 90 top
R3  21.59,20.74 90 top
R4  18.92,23.29 90 top
R5  18.94,18.8 90 top
R6  8.09,23.1 90 top
R7  8.19,18.71 90 top
R8  17.82,11.54 90 top
R9  23.02,29.01 180 top
R10  23.83,40.66 90 top
R11  21.59,40.74 90 top
R12  18.92,43.29 90 top
R13  18.94,38.8 90 top
R14  8.09,43.1 90 top
R15  8.19,38.71 90 top
R16  17.82,31.54 90 top
R17  23.02,49.01 180 top
R18  23.83,60.66 90 top
R19  21.59,60.74 90 top
R20  18.92,63.29 90 top
R21  18.94,58.8 90 top
R22  8.09,63.1 90 top
R23  8.19,58.71 90 top
R24  17.82,51.54 90 top
R33  56.98,23.59 0 top
R34  56.17,11.94 270 top
R35  58.41,11.86 270 top
R36  61.08,9.31 270 top
R37  61.06,13.8 270 top
R38  71.91,9.5 270 top
R39  71.81,13.89 270 top
R40  62.18,21.06 270 top
R41  56.98,42.99 0 top
R42  56.17,31.34 270 top
R43  58.41,31.26 270 top
R44  61.08,28.71 270 top
R45  61.06,33.2 270 top
R46  71.91,28.9 270 top
R47  71.81,33.29 270 top
R48  62.18,40.46 270 top
R49  56.98,62.99 0 top
R50  56.17,51.34 270 top
R51  58.41,51.26 270 top
R52  61.08,48.71 270 top
R53  61.06,53.2 270 top
R54  71.91,48.9 270 top
R55  71.81,53.29 270 top
R56  62.18,60.46 270 top
R65  39,-60 0 top  (outside the outline)
R66  44,-60 0 top  (outside the outline)
R67  50,-55 0 top  (outside the outline)
R68  56,-55 0 top  (outside the outline)
R69  2,-60 0 top  (outside the outline)
R70  49,-60 0 top  (outside the outline)
R71  49,-26 0 top  (outside the outline)
R72  8,-60 0 top  (outside the outline)
R73  54,-60 0 top  (outside the outline)
R74  2,-65 0 top  (outside the outline)
R75  57,-26 0 top  (outside the outline)
R76  7,-65 0 top  (outside the outline)
R77  12,-65 0 top  (outside the outline)
R78  -51,-233 0 top  (outside the outline)
R79  39,-34 0 top  (outside the outline)
R80  51,-34 0 top  (outside the outline)
R81  6,-42 0 top  (outside the outline)
R82  18,-42 0 top  (outside the outline)
R83  30,-42 0 top  (outside the outline)
R84  42,-42 0 top  (outside the outline)
R85  54,-42 0 top  (outside the outline)
R86  6,-49 0 top  (outside the outline)
SJ2  38,-49 0 top  (outside the outline)
SW2  -50,-218 0 top  (outside the outline)
U$1  10.5,9.52 270 top
U$3  22.84,13.02 0 top
U$4  12.91,23.24 270 top
U$5  13,18.75 270 top
U$6  16.44,23.23 90 top
U$7  16.38,18.78 90 top
U$8  10.5,29.52 270 top
U$10  22.84,33.02 0 top
U$11  12.91,43.24 270 top
U$12  13,38.75 270 top
U$13  16.44,43.23 90 top
U$14  16.38,38.78 90 top
U$15  10.5,49.52 270 top
U$17  22.84,53.02 0 top
U$18  12.91,63.24 270 top
U$19  13,58.75 270 top
U$20  16.44,63.23 90 top
U$21  16.38,58.78 90 top
U$29  69.5,23.08 90 top
U$31  57.16,19.58 180 top
U$32  67.09,9.36 90 top
U$33  67,13.85 90 top
U$34  63.56,9.37 270 top
U$35  63.62,13.82 270 top
U$36  69.5,42.48 90 top
U$38  57.16,38.98 180 top
U$39  67.09,28.76 90 top
U$40  67,33.25 90 top
U$41  63.56,28.77 270 top
U$42  63.62,33.22 270 top
U$43  69.5,62.48 90 top
U$45  57.16,58.98 180 top
U$46  67.09,48.76 90 top
U$47  67,53.25 90 top
U$48  63.56,48.77 270 top
U$49  63.62,53.22 270 top
U$57  60,-64 0 top  (outside the outline)
U$58  2,-69 0 top  (outside the outline)
U$59  16,-34 0 top  (outside the outline)
U$60  33,-49 0 top  (outside the outline)
VAR4  -48,-246 0 top  (outside the outline)
VAR5A  -46,22 0 top  (outside the outline)
VAR5B  11,-206 0 top  (outside the outline)
VAR5C  11,-212 0 top  (outside the outline)

### Tracks (layer width: path | path; a pad name or v marks a point on that pad's centre or on a via)
1W  (3 unrouted)
B-1  (via drill 0.35)  (1 unrouted)
  Top 0.5: 21.88,15.25 21.88,16.12 21.62,16.38 C2.2 | 21.88,15.25 21.88,14.38 U$3.6 | C4.2 10.38,17.88 11.62,17.88 U$5.3 11.88,17.62 13.25,17.62 13.88,17 17.5,17 | 17.5,17 17.5,14.62 17.75,14.38 R8.2 18,14.25 19.5,12.75 23.5,12.75 23.75,13 | 17.5,17 17.5,17.75 U$7.1 | 24,15.38 24,16.38 C1.2 | 24,15.38 24.5,14.88 24.5,13.75 23.75,13 | v22,15.25 21.88,15.25 | v23.88,15.25 24,15.38 | 3.88,9.75 5.12,9.75 7.25,7.62 15.75,7.62 16,7.38 23.88,7.38 24.88,8.38 24.88,11.88 23.75,13
  Bottom 0.5: v23.88,15.25 v22,15.25
B-2  (via drill 0.35)  (1 unrouted)
  Top 0.5: 58.12,56.75 58.12,55.88 58.38,55.62 C26.2 | 58.12,56.75 58.12,57.62 U$45.6 | C28.2 69.62,54.12 68.38,54.12 U$47.3 68.12,54.38 66.75,54.38 66.12,55 62.5,55 | 62.5,55 62.5,57.38 62.25,57.62 R56.2 62,57.75 60.5,59.25 56.5,59.25 56.25,59 | 62.5,55 62.5,54.25 U$49.1 | 56,56.62 56,55.62 C25.2 | 56,56.62 55.5,57.12 55.5,58.25 56.25,59 | v58,56.75 58.12,56.75 | v56.12,56.75 56,56.62 | 76.12,62.25 74.88,62.25 72.75,64.38 64.25,64.38 64,64.62 56.12,64.62 55.12,63.62 55.12,60.12 56.25,59
  Bottom 0.5: v56.12,56.75 v58,56.75
B-3  (via drill 0.35)  (1 unrouted)
  Top 0.5: 21.88,35.25 21.88,36.12 21.62,36.38 C6.2 | 21.88,35.25 21.88,34.38 U$10.6 | C8.2 10.38,37.88 11.62,37.88 U$12.3 11.88,37.62 13.25,37.62 13.88,37 17.5,37 | 17.5,37 17.5,34.62 17.75,34.38 R16.2 18,34.25 19.5,32.75 23.5,32.75 23.75,33 | 17.5,37 17.5,37.75 U$14.1 | 24,35.38 24,36.38 C5.2 | 24,35.38 24.5,34.88 24.5,33.75 23.75,33 | v22,35.25 21.88,35.25 | v23.88,35.25 24,35.38 | 3.88,29.75 5.12,29.75 7.25,27.62 15.75,27.62 16,27.38 23.88,27.38 24.88,28.38 24.88,31.88 23.75,33
  Bottom 0.5: v23.88,35.25 v22,35.25
B-4  (via drill 0.35)  (1 unrouted)
  Top 0.5: 58.12,36.75 58.12,35.88 58.38,35.62 C22.2 | 58.12,36.75 58.12,37.62 U$38.6 | C24.2 69.62,34.12 68.38,34.12 U$40.3 68.12,34.38 66.75,34.38 66.12,35 62.5,35 | 62.5,35 62.5,37.38 62.25,37.62 R48.2 62,37.75 60.5,39.25 56.5,39.25 56.25,39 | 62.5,35 62.5,34.25 U$42.1 | 56,36.62 56,35.62 C21.2 | 56,36.62 55.5,37.12 55.5,38.25 56.25,39 | v58,36.75 58.12,36.75 | v56.12,36.75 56,36.62 | 76.12,42.25 74.88,42.25 72.75,44.38 64.25,44.38 64,44.62 56.12,44.62 55.12,43.62 55.12,40.12 56.25,39
  Bottom 0.5: v56.12,36.75 v58,36.75
B-5  (via drill 0.35)  (1 unrouted)
  Top 0.5: 21.88,55.25 21.88,56.12 21.62,56.38 C10.2 | 21.88,55.25 21.88,54.38 U$17.6 | C12.2 10.38,57.88 11.62,57.88 U$19.3 11.88,57.62 13.25,57.62 13.88,57 17.5,57 | 17.5,57 17.5,54.62 17.75,54.38 R24.2 18,54.25 19.5,52.75 23.5,52.75 23.75,53 | 17.5,57 17.5,57.75 U$21.1 | 24,55.38 24,56.38 C9.2 | 24,55.38 24.5,54.88 24.5,53.75 23.75,53 | v22,55.25 21.88,55.25 | v23.88,55.25 24,55.38 | 3.88,49.75 5.12,49.75 7.25,47.62 15.75,47.62 16,47.38 23.88,47.38 24.88,48.38 24.88,51.88 23.75,53
  Bottom 0.5: v23.88,55.25 v22,55.25
B-6  (via drill 0.35)  (1 unrouted)
  Top 0.5: 58.12,17.35 58.12,16.48 58.38,16.23 C18.2 | 58.12,17.35 58.12,18.23 U$31.6 | C20.2 69.62,14.72 68.38,14.72 U$33.3 68.12,14.97 66.75,14.97 66.12,15.6 62.5,15.6 | 62.5,15.6 62.5,17.98 62.25,18.23 R40.2 62,18.35 60.5,19.85 56.5,19.85 56.25,19.6 | 62.5,15.6 62.5,14.85 U$35.1 | 56,17.23 56,16.23 C17.2 | 56,17.23 55.5,17.73 55.5,18.85 56.25,19.6 | v58,17.35 58.12,17.35 | v56.12,17.35 56,17.23 | 76.12,22.85 74.88,22.85 72.75,24.98 64.25,24.98 64,25.23 56.12,25.23 55.12,24.23 55.12,20.73 56.25,19.6
  Bottom 0.5: v56.12,17.35 v58,17.35
BMS+  (13 unrouted)
  Top 0.5: R2.2 23.75,21.62 21.25,24.12 19,24.12 R4.2 18.75,24.25 18,25 9.12,25 8.25,24.12 R6.2 8,23.88 5.25,23.88 3.88,22.5 | R10.2 23.75,41.62 21.25,44.12 19,44.12 R12.2 18.75,44.25 18,45 9.12,45 8.25,44.12 R14.2 8,43.88 5.25,43.88 3.88,42.5 | R18.2 23.75,61.62 21.25,64.12 19,64.12 R20.2 18.75,64.25 18,65 9.12,65 8.25,64.12 R22.2 8,63.88 5.25,63.88 3.88,62.5 | R34.2 56.25,10.97 58.75,8.47 61,8.47 R36.2 61.25,8.35 62,7.6 70.88,7.6 71.75,8.47 R38.2 72,8.72 74.75,8.72 76.12,10.1 | R42.2 56.25,30.38 58.75,27.88 61,27.88 R44.2 61.25,27.75 62,27 70.88,27 71.75,27.88 R46.2 72,28.12 74.75,28.12 76.12,29.5 | R50.2 56.25,50.38 58.75,47.88 61,47.88 R52.2 61.25,47.75 62,47 70.88,47 71.75,47.88 R54.2 72,48.12 74.75,48.12 76.12,49.5
BUS+  (2 unrouted)
GND  (50 unrouted)
N$1
  Top 0.5: U$3.5 22.88,14.38 22.88,17.12 23.88,18.12 C1.1 23.88,18.38 23.88,19.75 R2.1
N$2
  Top 0.5: U$5.2 11.12,18.75 10.38,19.5 C4.1 10.12,19.75 8.25,17.88 R7.1
N$3
  Top 0.5: U$3.3 23.75,11.62 23.75,9.12 R1.1
N$4
  Top 0.5: U$4.2 11.5,23.25 10.88,23.25 10.25,23.88 C3.1 10,23.88 8.38,22.25 R6.1
N$5  (5 unrouted)
N$6
  Top 0.5: U$4.6 14.25,24.12 14.5,24.12 15.38,23.25 U$6.3
N$7
  Top 0.5: U$6.2 17.5,24.12 17.5,23.88 18.88,22.5 R4.1
N$8  (1 unrouted)
  Top 0.5: 17.5,21.5 17.5,21.12 18.88,19.75 R5.2 | 17.5,21.5 17.5,22.25 U$6.1 | 17.5,21.5 21.5,21.5 R3.2 | 10.75,22.25 10.25,22.25 C3.2 | 10.75,22.25 11.5,22.25 U$4.3 | 10.25,21.62 10.75,22.12 10.75,22.25 | 10.25,21.62 8.25,19.62 R7.2 8,19.5 7.12,19.5 3.88,16.25 | 17.5,21.5 10.38,21.5 10.25,21.62
N$9
  Top 0.5: U$5.6 14.38,19.62 14.62,19.62 15.38,18.88 U$7.3
N$10
  Top 0.5: U$7.2 17.5,19.62 17.5,19.38 18.88,18 R5.1
N$13  (2 unrouted)
  Top 0.5: 13.62,9.25 17.25,9.25 17.75,8.75 R8.1 | 13.62,12.75 14,12.75 17.38,9.38 R8.1 | R1.2 22.12,9 17.88,9 R8.1
N$15
  Top 0.5: U$3.4 23.75,14.25 23.75,14 23.25,13.5 21.5,13.5 20.62,14.38 20.62,17.25 21.5,18.12 C2.1 21.62,18.38 21.62,19.88 R3.1
N$16
  Top 0.5: U$10.5 22.88,34.38 22.88,37.12 23.88,38.12 C5.1 23.88,38.38 23.88,39.75 R10.1
N$18
  Top 0.5: U$10.3 23.75,31.62 23.75,29.12 R9.1
N$19
  Top 0.5: U$11.2 11.5,43.25 10.88,43.25 10.25,43.88 C7.1 10,43.88 8.38,42.25 R14.1
N$20
  Top 0.5: U$11.6 14.25,44.12 14.5,44.12 15.38,43.25 U$13.3
N$21
  Top 0.5: U$13.2 17.5,44.12 17.5,43.88 18.88,42.5 R12.1
N$22
  Top 0.5: U$12.6 14.38,39.62 14.62,39.62 15.38,38.88 U$14.3
N$23
  Top 0.5: U$14.2 17.5,39.62 17.5,39.38 18.88,38 R13.1
N$24  (2 unrouted)
  Top 0.5: 13.62,29.25 17.25,29.25 17.75,28.75 R16.1 | 13.62,32.75 14,32.75 17.38,29.38 R16.1 | R9.2 22.12,29 17.88,29 R16.1
N$27
  Top 0.5: U$10.4 23.75,34.25 23.75,34 23.25,33.5 21.5,33.5 20.62,34.38 20.62,37.25 21.5,38.12 C6.1 21.62,38.38 21.62,39.88 R11.1
N$28
  Top 0.5: U$12.2 11.12,38.75 10.38,39.5 C8.1 10.12,39.75 8.25,37.88 R15.1
N$30  (1 unrouted)
  Top 0.5: 17.5,41.5 17.5,41.12 18.88,39.75 R13.2 | 17.5,41.5 17.5,42.25 U$13.1 | 17.5,41.5 21.5,41.5 R11.2 | 10.75,42.25 10.25,42.25 C7.2 | 10.75,42.25 11.5,42.25 U$11.3 | 10.25,41.62 10.75,42.12 10.75,42.25 | 10.25,41.62 8.25,39.62 R15.2 8,39.5 7.12,39.5 3.88,36.25 | 17.5,41.5 10.38,41.5 10.25,41.62
N$33
  Top 0.5: U$17.5 22.88,54.38 22.88,57.12 23.88,58.12 C9.1 23.88,58.38 23.88,59.75 R18.1
N$34
  Top 0.5: U$17.3 23.75,51.62 23.75,49.12 R17.1
N$35
  Top 0.5: U$18.2 11.5,63.25 10.88,63.25 10.25,63.88 C11.1 10,63.88 8.38,62.25 R22.1
N$36
  Top 0.5: U$18.6 14.25,64.12 14.5,64.12 15.38,63.25 U$20.3
N$37
  Top 0.5: U$20.2 17.5,64.12 17.5,63.88 18.88,62.5 R20.1
N$38
  Top 0.5: U$19.6 14.38,59.62 14.62,59.62 15.38,58.88 U$21.3
N$39
  Top 0.5: U$21.2 17.5,59.62 17.5,59.38 18.88,58 R21.1
N$40  (2 unrouted)
  Top 0.5: 13.62,49.25 17.25,49.25 17.75,48.75 R24.1 | 13.62,52.75 14,52.75 17.38,49.38 R24.1 | R17.2 22.12,49 17.88,49 R24.1
N$43
  Top 0.5: U$17.4 23.75,54.25 23.75,54 23.25,53.5 21.5,53.5 20.62,54.38 20.62,57.25 21.5,58.12 C10.1 21.62,58.38 21.62,59.88 R19.1
N$44
  Top 0.5: U$19.2 11.12,58.75 10.38,59.5 C12.1 10.12,59.75 8.25,57.88 R23.1
N$46  (1 unrouted)
  Top 0.5: 17.5,61.5 17.5,61.12 18.88,59.75 R21.2 | 17.5,61.5 17.5,62.25 U$20.1 | 17.5,61.5 21.5,61.5 R19.2 | 10.75,62.25 10.25,62.25 C11.2 | 10.75,62.25 11.5,62.25 U$18.3 | 10.25,61.62 10.75,62.12 10.75,62.25 | 10.25,61.62 8.25,59.62 R23.2 8,59.5 7.12,59.5 3.88,56.25 | 17.5,61.5 10.38,61.5 10.25,61.62
N$65
  Top 0.5: U$31.5 57.12,18.23 57.12,15.47 56.12,14.47 C17.1 56.12,14.22 56.12,12.85 R34.1
N$66
  Top 0.5: U$31.3 56.25,20.98 56.25,23.48 R33.1
N$67
  Top 0.5: U$32.2 68.5,9.35 69.12,9.35 69.75,8.72 C19.1 70,8.72 71.62,10.35 R38.1
N$68
  Top 0.5: U$32.6 65.75,8.47 65.5,8.47 64.62,9.35 U$34.3
N$69
  Top 0.5: U$34.2 62.5,8.47 62.5,8.72 61.12,10.1 R36.1
N$70
  Top 0.5: U$33.6 65.62,12.97 65.38,12.97 64.62,13.72 U$35.3
N$71
  Top 0.5: U$35.2 62.5,12.97 62.5,13.22 61.12,14.6 R37.1
N$72  (2 unrouted)
  Top 0.5: 66.38,23.35 62.75,23.35 62.25,23.85 R40.1 | 66.38,19.85 66,19.85 62.62,23.23 R40.1 | R33.2 57.88,23.6 62.12,23.6 R40.1
N$75
  Top 0.5: U$31.4 56.25,18.35 56.25,18.6 56.75,19.1 58.5,19.1 59.38,18.23 59.38,15.35 58.5,14.47 C18.1 58.38,14.22 58.38,12.72 R35.1
N$76
  Top 0.5: U$33.2 68.88,13.85 69.62,13.1 C20.1 69.88,12.85 71.75,14.72 R39.1
N$78  (1 unrouted)
  Top 0.5: 62.5,11.1 62.5,11.47 61.12,12.85 R37.2 | 62.5,11.1 62.5,10.35 U$34.1 | 62.5,11.1 58.5,11.1 R35.2 | 69.25,10.35 69.75,10.35 C19.2 | 69.25,10.35 68.5,10.35 U$32.3 | 69.75,10.97 69.25,10.47 69.25,10.35 | 69.75,10.97 71.75,12.97 R39.2 72,13.1 72.88,13.1 76.12,16.35 | 62.5,11.1 69.62,11.1 69.75,10.97
N$81
  Top 0.5: U$38.5 57.12,37.62 57.12,34.88 56.12,33.88 C21.1 56.12,33.62 56.12,32.25 R42.1
N$82
  Top 0.5: U$38.3 56.25,40.38 56.25,42.88 R41.1
N$83
  Top 0.5: U$39.2 68.5,28.75 69.12,28.75 69.75,28.12 C23.1 70,28.12 71.62,29.75 R46.1
N$84
  Top 0.5: U$39.6 65.75,27.88 65.5,27.88 64.62,28.75 U$41.3
N$85
  Top 0.5: U$41.2 62.5,27.88 62.5,28.12 61.12,29.5 R44.1
N$86
  Top 0.5: U$40.6 65.62,32.38 65.38,32.38 64.62,33.12 U$42.3
N$87
  Top 0.5: U$42.2 62.5,32.38 62.5,32.62 61.12,34 R45.1
N$88  (2 unrouted)
  Top 0.5: 66.38,42.75 62.75,42.75 62.25,43.25 R48.1 | 66.38,39.25 66,39.25 62.62,42.62 R48.1 | R41.2 57.88,43 62.12,43 R48.1
N$91
  Top 0.5: U$38.4 56.25,37.75 56.25,38 56.75,38.5 58.5,38.5 59.38,37.62 59.38,34.75 58.5,33.88 C22.1 58.38,33.62 58.38,32.12 R43.1
N$92
  Top 0.5: U$40.2 68.88,33.25 69.62,32.5 C24.1 69.88,32.25 71.75,34.12 R47.1
N$94  (1 unrouted)
  Top 0.5: 62.5,30.5 62.5,30.88 61.12,32.25 R45.2 | 62.5,30.5 62.5,29.75 U$41.1 | 62.5,30.5 58.5,30.5 R43.2 | 69.25,29.75 69.75,29.75 C23.2 | 69.25,29.75 68.5,29.75 U$39.3 | 69.75,30.38 69.25,29.88 69.25,29.75 | 69.75,30.38 71.75,32.38 R47.2 72,32.5 72.88,32.5 76.12,35.75 | 62.5,30.5 69.62,30.5 69.75,30.38
N$97
  Top 0.5: U$45.5 57.12,57.62 57.12,54.88 56.12,53.88 C25.1 56.12,53.62 56.12,52.25 R50.1
N$98
  Top 0.5: U$45.3 56.25,60.38 56.25,62.88 R49.1
N$99
  Top 0.5: U$46.2 68.5,48.75 69.12,48.75 69.75,48.12 C27.1 70,48.12 71.62,49.75 R54.1
N$100
  Top 0.5: U$46.6 65.75,47.88 65.5,47.88 64.62,48.75 U$48.3
N$101
  Top 0.5: U$48.2 62.5,47.88 62.5,48.12 61.12,49.5 R52.1
N$102
  Top 0.5: U$47.6 65.62,52.38 65.38,52.38 64.62,53.12 U$49.3
N$103
  Top 0.5: U$49.2 62.5,52.38 62.5,52.62 61.12,54 R53.1
N$104  (2 unrouted)
  Top 0.5: 66.38,62.75 62.75,62.75 62.25,63.25 R56.1 | 66.38,59.25 66,59.25 62.62,62.62 R56.1 | R49.2 57.88,63 62.12,63 R56.1
N$107
  Top 0.5: U$45.4 56.25,57.75 56.25,58 56.75,58.5 58.5,58.5 59.38,57.62 59.38,54.75 58.5,53.88 C26.1 58.38,53.62 58.38,52.12 R51.1
N$108
  Top 0.5: U$47.2 68.88,53.25 69.62,52.5 C28.1 69.88,52.25 71.75,54.12 R55.1
N$110  (1 unrouted)
  Top 0.5: 62.5,50.5 62.5,50.88 61.12,52.25 R53.2 | 62.5,50.5 62.5,49.75 U$48.1 | 62.5,50.5 58.5,50.5 R51.2 | 69.25,49.75 69.75,49.75 C27.2 | 69.25,49.75 68.5,49.75 U$46.3 | 69.75,50.38 69.25,49.88 69.25,49.75 | 69.75,50.38 71.75,52.38 R55.2 72,52.5 72.88,52.5 76.12,55.75 | 62.5,50.5 69.62,50.5 69.75,50.38
N$129  (1 unrouted)
N$131  (3 unrouted)
N$132  (3 unrouted)
N$133  (3 unrouted)
N$134  (5 unrouted)
N$135  (1 unrouted)
N$136  (1 unrouted)
N$137  (6 unrouted)
N$138  (3 unrouted)
N$139  (1 unrouted)
N$140  (2 unrouted)
N$141  (2 unrouted)
N$142  (1 unrouted)
N$143  (2 unrouted)
N$144  (1 unrouted)
N$145  (3 unrouted)
N$147  (2 unrouted)
N$148  (2 unrouted)
N$150  (2 unrouted)
N$151  (2 unrouted)
N$152  (2 unrouted)
N$153  (2 unrouted)
N$154  (1 unrouted)
N$155  (2 unrouted)
N$156  (2 unrouted)
N$157  (2 unrouted)
N$158  (2 unrouted)
N$159  (1 unrouted)
N$160  (1 unrouted)
N$161  (1 unrouted)
OC1  (1 unrouted)
  Top 0.5: 13.5,14 14.12,14 14.38,13.75 14.38,13.62 17,11 22.38,11 22.75,11.38 22.75,11.62 U$3.2
OC2  (1 unrouted)
  Top 0.5: 66.5,58 65.88,58 65.62,58.25 65.62,58.38 63,61 57.62,61 57.25,60.62 57.25,60.38 U$45.2
OC3  (1 unrouted)
  Top 0.5: 13.5,34 14.12,34 14.38,33.75 14.38,33.62 17,31 22.38,31 22.75,31.38 22.75,31.62 U$10.2
OC4  (1 unrouted)
  Top 0.5: 66.5,38 65.88,38 65.62,38.25 65.62,38.38 63,41 57.62,41 57.25,40.62 57.25,40.38 U$38.2
OC5  (1 unrouted)
  Top 0.5: 13.5,54 14.12,54 14.38,53.75 14.38,53.62 17,51 22.38,51 22.75,51.38 22.75,51.62 U$17.2
OC6  (1 unrouted)
  Top 0.5: 66.5,18.6 65.88,18.6 65.62,18.85 65.62,18.98 63,21.6 57.62,21.6 57.25,21.23 57.25,20.98 U$31.2
OD1  (1 unrouted)
  Top 0.5: 9.12,14.75 8.25,14.75 7.5,14 | 9.12,14.75 14.38,14.75 15,14.12 15,14 17.25,11.75 21.88,11.75 U$3.1 | 7.5,8.5 8,8.5 9.12,9.62 9.12,14.75
OD2  (1 unrouted)
  Top 0.5: 70.88,57.25 71.75,57.25 72.5,58 | 70.88,57.25 65.62,57.25 65,57.88 65,58 62.75,60.25 58.12,60.25 U$45.1 | 72.5,63.5 72,63.5 70.88,62.38 70.88,57.25
OD3  (1 unrouted)
  Top 0.5: 9.12,34.75 8.25,34.75 7.5,34 | 9.12,34.75 14.38,34.75 15,34.12 15,34 17.25,31.75 21.88,31.75 U$10.1 | 7.5,28.5 8,28.5 9.12,29.62 9.12,34.75
OD4  (1 unrouted)
  Top 0.5: 70.88,37.25 71.75,37.25 72.5,38 | 70.88,37.25 65.62,37.25 65,37.88 65,38 62.75,40.25 58.12,40.25 U$38.1 | 72.5,43.5 72,43.5 70.88,42.38 70.88,37.25
OD5  (1 unrouted)
  Top 0.5: 9.12,54.75 8.25,54.75 7.5,54 | 9.12,54.75 14.38,54.75 15,54.12 15,54 17.25,51.75 21.88,51.75 U$17.1 | 7.5,48.5 8,48.5 9.12,49.62 9.12,54.75
OD6  (1 unrouted)
  Top 0.5: 70.88,17.85 71.75,17.85 72.5,18.6 | 70.88,17.85 65.62,17.85 65,18.48 65,18.6 62.75,20.85 58.12,20.85 U$31.1 | 72.5,24.1 72,24.1 70.88,22.98 70.88,17.85
PGOOD  (1 unrouted)
RESET  (1 unrouted)
RUN  (1 unrouted)
SCL  (3 unrouted)
SCLTM  (1 unrouted)
SDA  (3 unrouted)
SDATM  (1 unrouted)
VDD  (23 unrouted)
VSS  (2 unrouted)

### Text on the board
bNames: B+ | B- | BC | BC | B- | B+ | B+ | B- | BC | BC | B- | B+ | B+ | B- | BC | BC | B- | B+ | B+ | B- | BC | BC | B- | B+